# EAGLE design CajeroV2.0 (EAGLE 8.7.0)
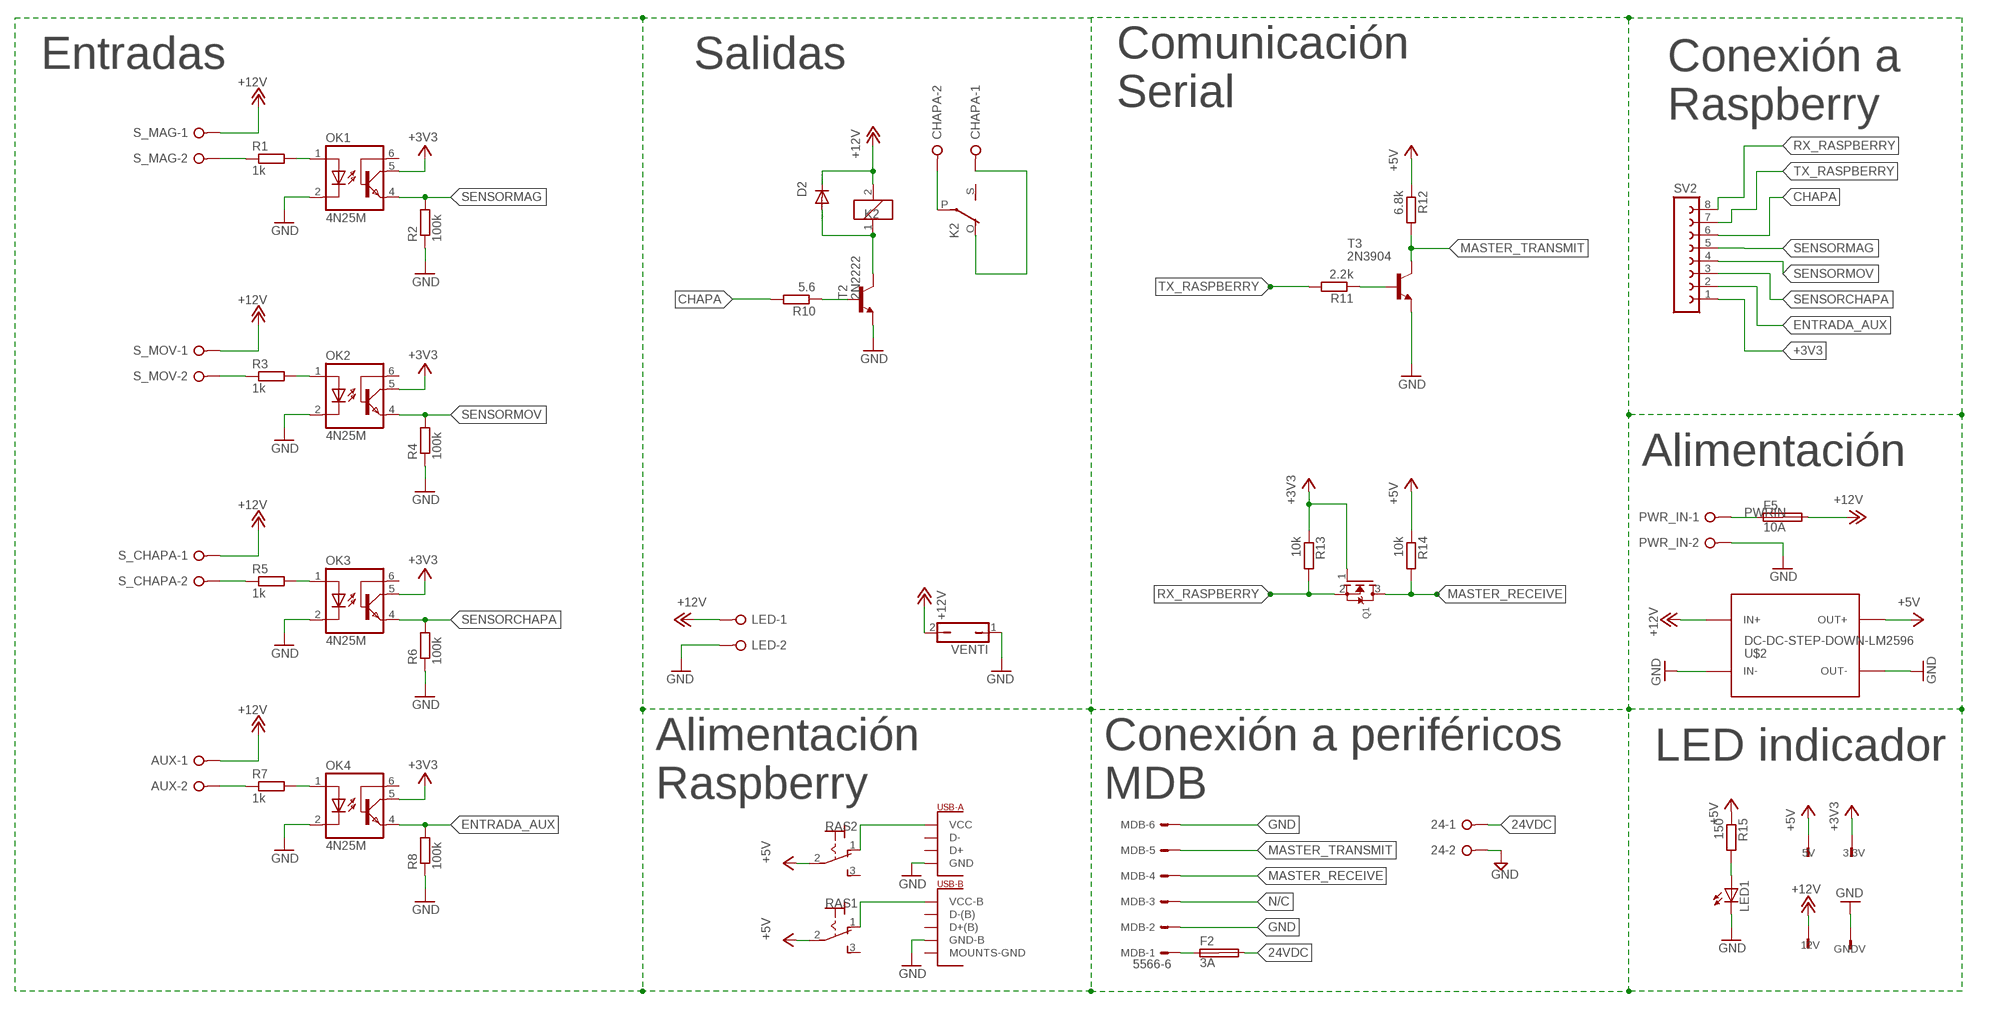
[diagram p0: schematic, sheet 1]

## Parts
3.3V  TSW-101-07-G-S  [TSW-101-XX-G-S]
5V  TSW-101-07-G-S  [TSW-101-XX-G-S]
12V  TSW-101-07-G-S  [TSW-101-XX-G-S]
24  W237-02P  [W237-132]
AUX  W237-02P  [W237-132]
CHAPA  W237-02P  [W237-132]
D2  1N4148DO35-10  [DO35-10]
F2  3A  SHK20L  [SHK20L]
F5  10A  SHK20L  [SHK20L]
GNDV  TSW-101-07-G-S  [TSW-101-XX-G-S]
K2  G5LE  [G5LE]
LED  W237-02P  [W237-132]
LED1  LED5MM  [LED5MM]
MDB  5566-6  [5566-6]
OK1  4N25M  [DIL06]
OK2  4N25M  [DIL06]
OK3  4N25M  [DIL06]
OK4  4N25M  [DIL06]
PWR_IN  W237-02P  [W237-132]
Q1  MOSFET-NREFLOW  [SOT23]
R1  1k  R-EU_0207/7  [0207/7]
R2  100k  R-EU_0207/7  [0207/7]
R3  1k  R-EU_0207/7  [0207/7]
R4  100k  R-EU_0207/7  [0207/7]
R5  1k  R-EU_0207/7  [0207/7]
R6  100k  R-EU_0207/7  [0207/7]
R7  1k  R-EU_0207/7  [0207/7]
R8  100k  R-EU_0207/7  [0207/7]
R10  5.6  R-EU_0207/7  [0207/7]
R11  2.2k  R-EU_0207/7  [0207/7]
R12  6.8k  R-EU_0207/7  [0207/7]
R13  10k  R-EU_0207/7  [0207/7]
R14  10k  R-EU_0207/7  [0207/7]
R15  150  R-EU_0207/7  [0207/7]
RAS1  320-916  [320-916]
RAS2  320-916  [320-916]
S_CHAPA  W237-02P  [W237-132]
S_MAG  W237-02P  [W237-132]
S_MOV  W237-02P  [W237-132]
SV2  FE08-1  [FE08]
T2  2N2222  [TO18]
T3  2N3904  [TO92]
U$1  DUAL-PORT-USB-REC  [DUAL-PORT-USB]
U$2  DC-DC-STEP-DOWN-LM2596  [DC-DC-STEP-DOWN-LM2596]
VENTI  JP1Q  [JP1]

## Nets
24VDC: 24.1 F2.2A
+3V3: 3.3V.1 OK1.5(COL) OK2.5(COL) OK3.5(COL) OK4.5(COL) Q1.1(G) R13.1 SV2.1
+5V: 5V.1 R12.1 R14.1 R15.1 RAS1.2(P) RAS2.2(P) U$2.OUT+
+12V: 12V.1 AUX.1 D2.C F5.2A K2.2 LED.1 S_CHAPA.1 S_MAG.1 S_MOV.1 U$2.IN+ VENTI.2
CHAPA: R10.2 SV2.6
ENTRADA_AUX: OK4.4(EMI) R8.2 SV2.2
GND: 24.2 GNDV.1 LED1.K(C) LED.2 MDB.2 MDB.6 OK1.2(C) OK2.2(C) OK3.2(C) OK4.2(C) PWR_IN.2 R2.1 R4.1 R6.1 R8.1 T2.1(E) T3.3(E) U$1.P$9(GND-B) U$1.P$11(GND) U$2.IN- U$2.OUT- VENTI.1
MASTER_RECEIVE: MDB.4 Q1.3(D) R14.2
MASTER_TRANSMIT: MDB.5 R12.2 T3.1(C)
N$1: OK1.1(A) R1.2
N$2: R1.1 S_MAG.2
N$3: OK2.1(A) R3.2
N$4: R3.1 S_MOV.2
N$5: OK3.1(A) R5.2
N$6: R5.1 S_CHAPA.2
N$7: OK4.1(A) R7.2
N$8: AUX.2 R7.1
N$10: R10.1 T2.2(B)
N$15: D2.A K2.1 T2.3(C)
N$16: CHAPA.2 K2.P(2:P)
N$17: CHAPA.1 K2.O(2:O)
N$18: R11.1 T3.2(B)
N$20: RAS2.1(O) U$1.P$12(VCC)
N$21: F2.1A MDB.1
N$23: LED1.A R15.2
N$25: RAS1.1(O) U$1.P$10(VCC-B)
N/C: MDB.3
PWRIN: F5.1A PWR_IN.1
RX_RASPBERRY: Q1.2(S) R13.2 SV2.8
SENSORCHAPA: OK3.4(EMI) R6.2 SV2.3
SENSORMAG: OK1.4(EMI) R2.2 SV2.5
SENSORMOV: OK2.4(EMI) R4.2 SV2.4
TX_RASPBERRY: R11.2 SV2.7
Unconnected: F2.1B F2.2B F5.1B F5.2B K2.S(2:S) OK1.6(BAS) OK2.6(BAS) OK3.6(BAS) OK4.6(BAS) RAS1.3(S) RAS2.3(S) U$1.P$5(D-(B)) U$1.P$6(D+(B)) U$1.P$7(D-) U$1.P$8(D+)

## Notes on the sheet
- Entradas | Salidas
- Comunicación
  Serial
- Conexión a 
  Raspberry
- Alimentación
- LED indicador
- Alimentación 
  Raspberry
- Conexión a periféricos
  MDB

## Power pins joined to a net without a drawn wire
MOUNTS-GND: U$1.GND(MOUNTS-GND) U$1.P$2(MOUNTS-GND) U$1.P$3(MOUNTS-GND) U$1.P$4(MOUNTS-GND)

## Library data of the parts
3.3V 5V 12V GNDV = con-samtec:TSW-101-*-G-S: THROUGH-HOLE .025" SQ POST HEADER Source: Samtec TSW.pdf; MF: Samtec Inc.; MPN: TSW-101-07-G-S
24 AUX CHAPA LED PWR_IN S_CHAPA S_MAG S_MOV = con-wago-508:W237-02P: WAGO SREW CLAMP; OC_FARNELL: unknown; OC_NEWARK: unknown
D2 = diode:1N4148: DIODE high speed (Philips)
F2 F5 = fuse:SHK20L: FUSE HOLDER 5 x 20 mm, SH contact, SHH1 Schukat, E1073 Buerklin; OC_FARNELL: unknown; OC_NEWARK: unknown
K2 = relay:G5LE: RELAY 1 x switch, 10 A/120 V AC, 8 A/30 V DC, Omron; OC_FARNELL: unknown; OC_NEWARK: unknown
LED1 = adafruit:LED: LED OSRAM: - CHIPLED LG R971, LG N971, LY N971, LG Q971, LY Q971, LO R971, LY R971 LH N974, LH R974 LS Q976, LO Q976, LY Q976 LO Q996 - Hyper CHIPLED LW Q18S LB Q993, LB Q99A, LB R99A - SideLED LS A670, LO A670, LY A670, LG A670, LP A670 LB A673, LV A673, LT A673, LW A673 LH A674 LY A675 LS A676, LA A676, LO A676, LY A676, LW A676 LS A679, LY A679, LG A679 - Hyper Micro SIDELED® LS Y876, LA Y876, LO Y876, LY Y876 LT Y87S - SmartLED LW L88C, LW L88S LB L89C, LB L89S, LG L890 LS L89K, LO L89K, LY L89K LS L896, LA L896, LO L896, LY L896 - TOPLED LS T670, LO T670, LY T670, LG T670, LP T670 LSG T670, LSP T670, LSY T670, LOP T670, LYG T670 LG T671, LOG T671, LSG T671 LB T673, LV T673, LT T673, LW T673 LH T674 LS T676, LA T676, LO T676, LY T676, LB T676, LH T676, LSB T676, LW T676 LB T67C, LV T67C, LT T67C, LS T67K, LO T67K, LY T67K, LW E67C LS E67B, LA E67B, LO E67B, LY E67B, LB E67C, LV E67C, LT E67C LW T67C LS T679, LY T679, LG T679 LS T770, LO T770, LY T770, LG T770, LP T770 LB T773, LV T773, LT T773, LW T773 LH T774 LS E675, LA E675, LY E675, LS T675 LS T776, LA T776, LO T776, LY T776, LB T776 LHGB T686 LT T68C, LB T68C - Hyper Mini TOPLED® LB M676 - Mini TOPLED Santana® LG M470 LS M47K, LO M47K, LY M47K Source: http://www.osram.convergy.de/
MDB = con-molex:5566-6: Mini FIT connector 6 pol Source: http://www.molex.com; MF: MOLEX; MPN: 95566-61002; OC_FARNELL: unknown; OC_NEWARK: 22K8620
OK1-OK4 = optocoupler:4N*?M: General Purpose 6-Pin Phototransistor Optocouplers Source: http://www.fairchildsemi.com/ds/4N/4N35-M.pdf; MPN: 4N25-M; OC_FARNELL: 1021349; OC_NEWARK: 98K9084
Q1 = adafruit:MOSFET-N: N-Channel Mosfet 2N7002E - 60V 260mA SOT23 [Digikey: 2N7002ET1GOSTR-ND] - REEL BSH103 - 30V 850mA SOT23 [Digikey: 568-5013-1-ND]
R1-R8 R10-R15 = rcl:R-EU_: RESISTOR, European symbol; SPICEPREFIX: R
RAS1 RAS2 = switch:320-916: TOGGLE SWITCH distributor RS Components
SV2 = con-lsta:FE08-1: FEMALE HEADER; OC_FARNELL: unknown; OC_NEWARK: unknown
T2 = transistor:2N2222: NPN TRANSISTOR
T3 = transistor:2N3904: NPN TRANSISTOR
U$1 = tps2511:DUAL-PORT-USB-REC: Dual USB Receptacle, Horizontal.
U$2 = diy-modules:DC-DC-STEP-DOWN-LM2596: DC/DC Step-Down Regulator based on LM2596-ADJ chip LM2596 datasheet available here: http://www.ti.com/lit/ds/symlink/lm2596.pdf Click here to find device on ebay.com <http://www.ebay.com/sch/lm2596+power+regulator>
VENTI = jumper:JP1Q: JUMPER

## Board
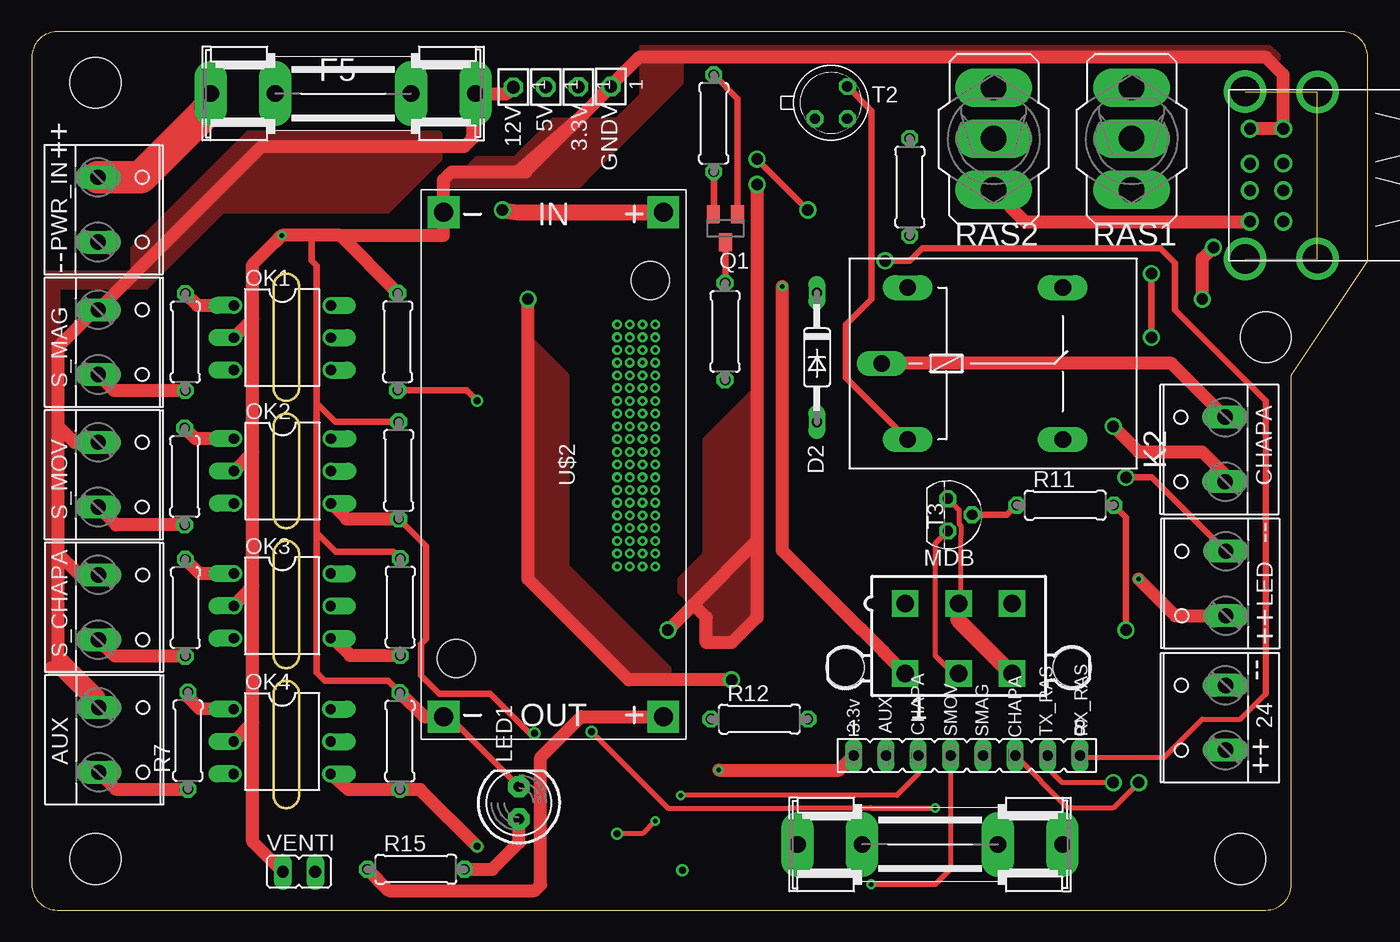
[diagram p1: board, top side]
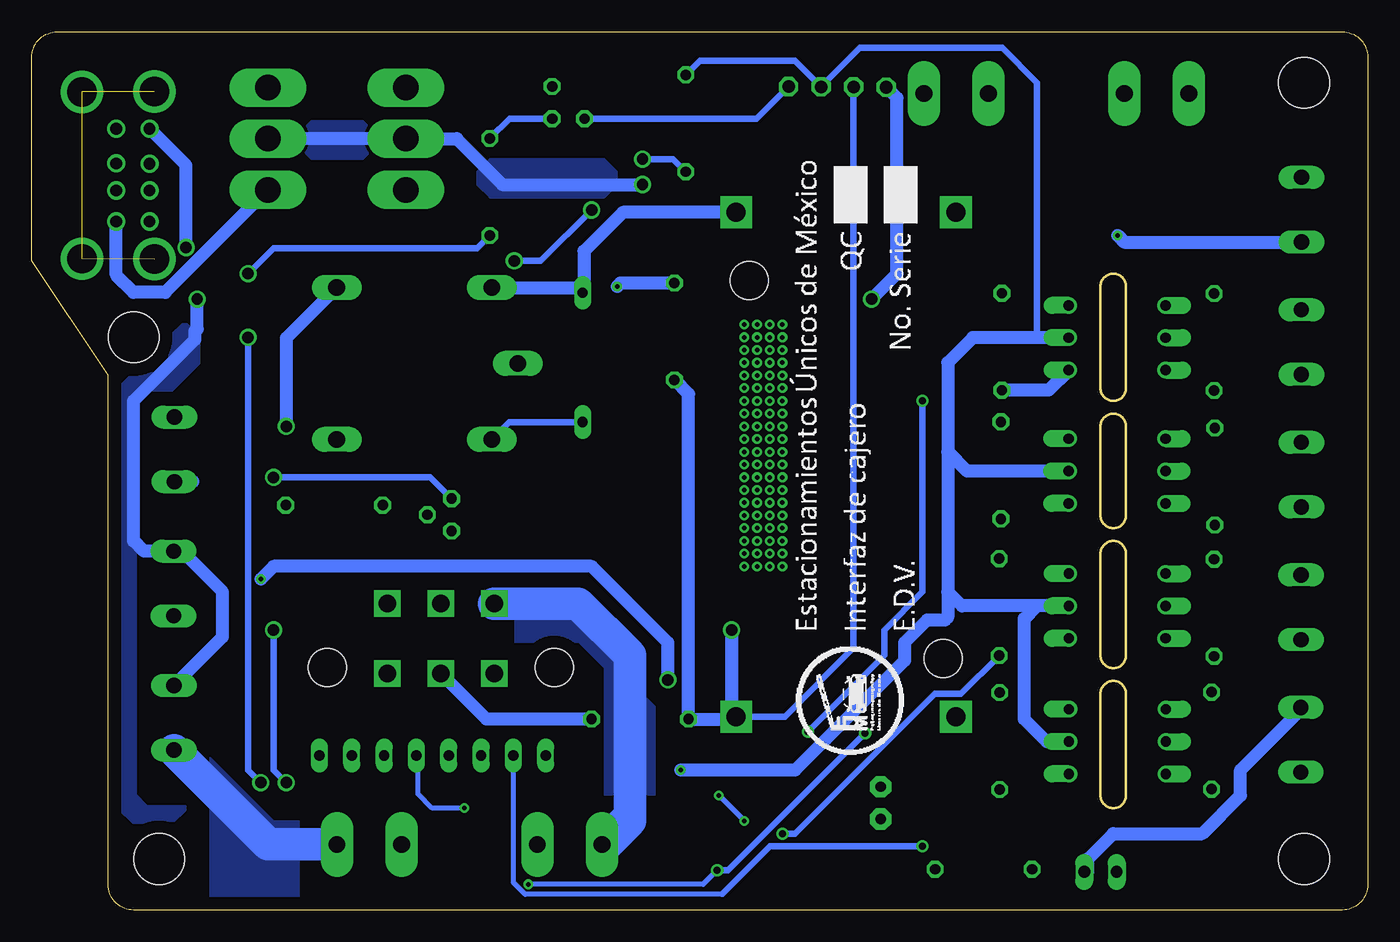
[diagram p2: board, bottom side, seen from below]

Size 105 x 69 mm. Coordinates in mm from the lower left corner, seen from the top.
Outline: 0,2 arc90 2,0 97,0 arc90 99,2 99,42 105,51 105,67 arc90 103,69 2,69 arc90 0,67 0,2
Outline: 19,49 19,41 arc180 21,41 21,49 arc180 19,49
Outline: 21,38 21,31 arc-180 19,31 19,38 arc-180 21,38
Outline: 21,28 21,20 arc-180 19,20 19,28 arc-180 21,28
Outline: 19,17 19,9 arc180 21,9 21,17 arc180 19,17
Copper layers (1*16): Top 0.035mm / dielectric 1.5mm / Bottom 0.035mm
Design rules "default": minimum track width 6mil, minimum drill 0.35mm, track to track 6mil, track to pad 6mil, pad to pad 6mil, via to via 6mil, smd to smd 6mil, copper to edge 40mil, drill to drill 6mil, minimum pad ring 10mil, minimum via ring 8mil, stop-mask expansion 4mil, vias tented up to drill 0mil, thermal gap 10mil
Holes 4 mm at 5,65 95,4 5,4 97,45

### Footprints (pad centres in the part's own frame; a part is rotated, then mirrored left to right if it is on the bottom)
TSW-101-XX-G-S = drill 1 pad 1.5 octagon: 1 0,0
W237-132 = drill 1.194 long: 1 -2.54,-0.635; 2 2.54,-0.635
DO35-10 = drill 0.813 long: A 5.08,0; C -5.08,0
SHK20L = drill 1.321 pad 2.54 long: 1A -10.414,0; 1B -5.334,0; 2A 10.414,0; 2B 5.334,0
G5LE = drill 1.321 long: 1 -7.493,-5.969; 2 -7.493,5.969; O 4.699,5.969; P -9.525,0; S 4.699,-5.969
LED5MM = drill 0.813 pad 1.676 octagon: A -1.27,0; K 1.27,0
5566-6 = drill 1.4 square: 1 4.2,-2.75; 2 0,-2.75; 3 -4.2,-2.75; 4 4.2,2.75; 5 0,2.75; 6 -4.2,2.75 | hole 3: 8.9,2.29; -8.9,2.29
DIL06 = drill 0.813 offset: 1 -2.54,-3.81; 2 0,-3.81; 3 2.54,-3.81; 4 2.54,3.81; 5 0,3.81; 6 -2.54,3.81
SOT23 = smd 1 x 1.4: 1 -0.95,-1.1; 2 0.95,-1.1; 3 0,1.1
0207/7 = drill 0.813 octagon: 1 -3.81,0; 2 3.81,0
320-916 = drill 2.007 long: 1 0,4.013; 2 0,0; 3 0,-4.013
FE08 = drill 0.813 long: 1 -8.89,0; 2 -6.35,0; 3 -3.81,0; 4 -1.27,0; 5 1.27,0; 6 3.81,0; 7 6.35,0; 8 8.89,0
TO18 = drill 0.813 octagon: 1 -1.27,-1.27; 2 1.27,-1.27; 3 1.27,1.27
TO92 = drill 0.813 octagon: 1 1.27,0; 2 0,1.905; 3 -1.27,0
DUAL-PORT-USB = drill 2.311: GND -7.645,0.127; P$2 -7.62,-5.563; P$3 5.512,0.127; P$4 5.486,-5.563 | drill 0.92: P$5 -2.261,-2.87; P$6 -0.127,-2.87; P$7 -2.261,-0.254; P$8 -0.152,-0.254; P$9 2.591,-2.87; P$10 -4.699,-2.87; P$11 2.591,-0.254; P$12 -4.699,-0.254
DC-DC-STEP-DOWN-LM2596 = drill 1.5 pad 2.5 square: IN+ -19.812,8.636; IN- -19.812,-8.636; OUT+ 19.812,8.636; OUT- 19.812,-8.636 | hole 3: -14.478,7.62; 15.24,-7.62
JP1 = drill 0.914 long: 1 0,-1.27; 2 0,1.27

### Placement (x,y rotation side)
3.3V  42.96,64.67 90 top
5V  40.4,64.67 90 top
12V  37.85,64.65 90 top
24  93.19,15.1 90 top
AUX  5.89,13.37 270 top
CHAPA  93.16,36.19 90 top
D2  61.71,43.42 270 top
F2  70.6,5.15 0 top
F5  24.47,64.15 0 top
GNDV  45.52,64.7 90 top
K2  76.33,42.94 0 top
LED  93.22,25.65 90 top
LED1  38.29,8.41 90 top
MDB  72.85,21.33 180 top
OK1  19.69,44.97 270 top
OK2  19.71,34.49 270 top
OK3  19.68,23.89 270 top
OK4  19.67,13.24 270 top
PWR_IN  5.83,55.02 270 top
Q1  54.52,53.56 180 top
R1  12.07,44.63 90 top
R2  28.76,44.65 270 top
R3  12.02,34.06 90 top
R4  28.83,34.54 270 top
R5  12.07,23.75 90 top
R6  28.96,23.8 270 top
R7  12.27,13.31 90 top
R8  28.93,13.27 270 top
R10  69,56.81 270 top
R11  81.23,31.81 0 top
R12  57.19,15 0 top
R13  53.6,61.81 270 top
R14  54.49,45.45 90 top
R15  30.19,3.2 0 top
RAS1  86.45,60.6 180 top
RAS2  75.61,60.6 180 top
S_CHAPA  5.87,23.79 270 top
S_MAG  5.85,44.62 270 top
S_MOV  5.85,34.2 270 top
SV2  73.5,12.15 0 top
T2  62.83,63.44 0 top
T3  72,31.05 270 top
U$1  95.49,58.79 90 top
U$2  41,35 270 top
VENTI  21,3 270 top

### Tracks (layer width: path | path; a pad name or v marks a point on that pad's centre or on a via)
24VDC
  Bottom 2.54: F2.2A 86.41,5.15 24.1
  pour Bottom: 84,7 84,1 91,1 91,12 86,7
+3V3  (via drill 0.35)
  Top 0.508: Q1.1 55.47,63.75 R13.1
  Top 1.016: v54,11 63.46,11 SV2.1
  Bottom 0.508: 26,44.97 26,65 28.73,67.73 39.9,67.73 3.3V.1 45,66.71 45,66.73 52.49,66.73 R13.1
  Bottom 1.016: OK1.5 26,44.97 31.03,44.97 33,43 33,36 | 33,36 33,25 | 33,25 33,23 33.22,22.78 34.63,22.78 36.4,21.01 36.4,19.6 45,11 v54,11 | OK2.5 31.49,34.49 33,36 | OK3.5 26,23.89 | 26,23.89 31.89,23.89 33,25 | OK4.5 25.23,13.23 27,15 27,22.89 26,23.89
+5V  (via drill 0.9)
  Top 1.016: R15.1 28.06,1.52 39.52,1.52 40,2 40,12 43.19,15.19 U$2.OUT+ | 52,24 57,29 v57,57 57,23 55,21 53,21 53,23 52,24 | 52,24 v50,22
  Bottom 0.508: 5V.1 40.4,20.6 45.81,15.19 U$2.OUT+ | 54.42,41.58 R14.1
  Bottom 1.016: v57,57 68,57 71.6,60.6 RAS2.2 RAS1.2 | v50,22 50,15.55 U$2.OUT+ 49.82,15 R12.1 53.38,40.53 54.42,41.58
  pour Top: 57,41 53,37 53,28 51,26 51,25 53,23 53,21 55,21 57,23
  pour Bottom: 83,62 79,62 78,61 78,60 79,59 83,59 84,60 84,61
  pour Bottom: 59,58 60,59 69,59 70,58 70,57 69,56 60,56 59,57
+12V  (via drill 0.35, 0.9)
  Top 0.152: 5,47.16 S_MAG.1
  Top 1.016: AUX.1 2.08,19.09 2.08,20 | 2.08,20 2.08,28 | 2.08,28 2.08,38 | 2.08,38 2.08,44.24 5,47.16 | S_CHAPA.1 3.76,26.33 2.08,28 | S_MOV.1 3.34,36.74 2.08,38 | S_MAG.1 18.05,60 34,60 34.63,60.63 F5.2A 37.34,64.15 12V.1 | v55,18.08 46.92,18.08 39,26 v39,48 | 2.08,20 5.26,16.83 AUX.1 | AUX.1 2.17,19 1.52,19 | v87,26 89.89,23.11 LED.1
  Top 1.27: v37,55 38.19,54.81 U$2.IN+
  Bottom 1.016: VENTI.2 22,3 22,4 20,6 13,6 10,9 10,11 5,16 AUX.1 | U$2.IN+ 58.55,54.81 61.59,51.77 61.59,48.62 | 61.59,48.62 D2.C | K2.2 61.89,48.91 61.59,48.62 | v39,48 37,50 v37,55 37,63.81 12V.1 | v55,18.08 55,21 61,27 86,27 v87,26
  pour Top: 2,49 9,49 15,55 28,55 32,59 32,61 17,61 8,52 8,51 8,50 2,50
  pour Top: 2,50 1,50 1,19 3,19 2,20 2,25
  pour Top: 39,45 42,42 42,27 50,19 50,18 47,18 39,26
CHAPA  (via drill 0.9)
  Top 0.406: v87,10 85,8 81.73,8 81.69,8.05 81.41,8.05 SV2.6
  Top 0.508: v88,50 v88,45
  Bottom 0.508: R10.2 70,52 86,52 v88,50 | v88,45 88,11 v87,10
ENTRADA_AUX  (via drill 0.55)
  Top 1.016: OK4.4 24.89,9.46 R8.2 30.54,9.46 v35,5
  Bottom 0.406: 50.73,1.27 50.78,1.22 66.22,1.22 67.15,2.15 SV2.2
  Bottom 0.508: v35,5 47,5 50.73,1.27
GND  (via drill 0.35, 0.9)
  Top 0.406: T3.3 72.89,31.43 72.89,30.33 73.02,30.2 73.02,29.36 73,29.34 73,24.23 MDB.2
  Top 0.508: 22,53 22,51 22.37,50.63 22.37,39.81 | R4.1 23.82,38.35 22.37,39.81 | R6.1 28.43,28.14 23.88,28.14 22.37,29.65 | 22.37,29.65 22.37,39.81 | R8.1 28.01,18 23,18 22.37,18.63 22.37,29.65 | LED1.K 32.78,15.19 U$2.OUT- | GNDV.1 44.88,64.14 37.82,58 | 32.36,57 32.36,54 | v86,34 88.05,34 LED.2
  Top 1.016: OK1.2 17.38,46.46 | 17.38,46.46 17.38,50.73 v19.64,53 | 24.22,53 32.36,53 32.36,54 U$2.IN- 32.36,57 32.36,57.36 33,58 37.82,58 38.82,58 GNDV.1 | OK2.2 17.38,35.97 | 17.38,35.97 17.38,46.46 | OK3.2 17.38,25.47 | 17.38,25.47 17.38,35.97 | 17.38,14.75 17.38,5.35 VENTI.1 | 17.38,14.75 17.38,25.47 | 19.13,52.48 v19.64,53 | R8.1 30.82,15.19 U$2.OUT- | R2.1 24.22,53 | 24.22,53 22,53 v19.64,53 | OK4.2 17.38,14.75 | 44.88,64.14 47.74,67 97,67 98.36,65.64 U$1.P$9 U$1.P$11 | v92,48 92,51.18 v92.87,52.05
  Top 1.27: MDB.6 72.85,22.78 MDB.2
  Bottom 0.508: T2.1 48.05,62.17 GNDV.1 | T3.3 73.68,34 v86,34
  Bottom 1.016: v19.64,53 19.13,52.48 PWR_IN.2 | v92,48 92,45.65 92.17,45.48 92.17,44.83 97,40 97,29 96.19,28.19 LED.2 93.19,28.19 90,25 90,21.47 24.2 | v92.87,52.05 92.87,58.51 U$1.P$11
  pour Top: 48,68 97,68 98,67 87,67 51,67 51,65 44,58 43,57 33,57 35,59 37,59 38,59 41,62 42,62 46,62 48,64
  pour Bottom: 97,7 98,8 98,41 97,42 95,42 94,43 94,45 93,46 92,45 92,43 94,41 96,41 97,40 97,9 96,8 93,8 94,7
MASTER_RECEIVE  (via drill 0.35)
  Top 0.508: Q1.3 54.52,49.29 R14.2
  Top 1.016: v59,49 59,28.23 65.17,22.06 65.2,22.06 66.97,20.29 66.97,20.26 MDB.4
  Bottom 1.016: v59,49 58.73,49.27 R14.2
MASTER_TRANSMIT
  Top 0.406: T3.1 71,28.78 71,20 72.42,18.58 MDB.5
  Bottom 1.016: R12.2 69.27,15 MDB.5
MOUNTS-GND  (3 unrouted)
N$1
  Top 1.016: R1.2 13,47.51 OK1.1
N$2
  Top 1.016: R1.1 6.47,40.82 S_MAG.2
N$3
  Top 1.016: OK2.1 12.86,37.03 R3.2
N$4
  Top 1.016: R3.1 6.62,30.25 S_MOV.2
N$5
  Top 1.016: OK3.1 13.2,26.43 R5.2
N$6
  Top 1.016: R5.1 6.54,19.94 S_CHAPA.2
N$7
  Top 1.016: OK4.1 13.17,15.83 12.27,16.73 R7.2
N$8
  Top 0.152: 12,9.5 R7.1
  Top 1.016: 12,9.5 6.59,9.5 AUX.2
N$10
  Bottom 0.508: R10.1 67.45,62.17 T2.2
N$11  (via drill 0.35)
  other vias: 49,45
N$12  (via drill 0.35)
  other vias: 48,45
N$13  (via drill 0.35)
  other vias: 47,45
N$14  (via drill 0.35)
  other vias: 46,46
N$15
  Top 0.508: T2.3 66,62.81 66,48 64,46 64,41.81 K2.1
  Bottom 0.508: D2.A 67.47,38.34 K2.1
N$16
  Top 1.016: CHAPA.2 89.58,42.94 K2.P
N$17  (via drill 0.9)
  Top 1.016: v85,38 87,36 92,36 93.79,34.21 CHAPA.1
  Bottom 1.016: 92.35,33.65 CHAPA.1 | K2.O 85,44.94 v85,38
N$18
  Top 0.508: R11.1 76.66,31.05 T3.2
N$19  (via drill 0.35)
  other vias: 46,45
N$20
  Top 1.016: RAS2.1 78.11,54.09 U$1.P$12
N$21
  Bottom 2.54: MDB.1 62.08,24.08 58,20 58,7 | 58,7 60,5 | F2.1A 58.34,7 58,7
  pour Bottom: 67,25 63,25 57,20 57,17 56,16 56,9 60,9 60,19 62,21 67,21
N$22  (via drill 0.35)
  other vias: 47,44
N$23
  Top 1.016: R15.2 36.2,3.2 38.3,5.31 38.29,5.32 LED1.A
N$24  (via drill 0.35)
  other vias: 48,44
N$25
  Bottom 1.016: RAS1.1 94.51,48.52 97,48.52 98.36,49.88 U$1.P$10
N$26  (via drill 0.35)
  other vias: 49,44
N$27  (via drill 0.35)
  other vias: 49,43
N$28  (via drill 0.35)
  other vias: 48,43
N$29  (via drill 0.35)
  other vias: 47,43
N$30  (via drill 0.35)
  other vias: 46,43
N$31  (via drill 0.35)
  other vias: 46,42
N$32  (via drill 0.35)
  other vias: 47,42
N$33  (via drill 0.35)
  other vias: 48,42
N$34  (via drill 0.35)
  other vias: 49,42
N$35  (via drill 0.35)
  other vias: 49,41
N$36  (via drill 0.35)
  other vias: 48,41
N$37  (via drill 0.35)
  other vias: 46,41
N$38  (via drill 0.35)
  other vias: 47,41
N$39  (via drill 0.35)
  other vias: 46,40
N$40  (via drill 0.35)
  other vias: 47,40
N$41  (via drill 0.35)
  other vias: 48,40
N$42  (via drill 0.35)
  other vias: 49,40
N$43  (via drill 0.35)
  other vias: 49,39
N$44  (via drill 0.35)
  other vias: 47,39
N$45  (via drill 0.35)
  other vias: 46,39
N$46  (via drill 0.35)
  other vias: 48,39
N$47  (via drill 0.35)
  other vias: 48,38
N$48  (via drill 0.35)
  other vias: 47,38
N$49  (via drill 0.35)
  other vias: 46,38
N$50  (via drill 0.35)
  other vias: 49,38
N$51  (via drill 0.35)
  other vias: 49,37
N$52  (via drill 0.35)
  other vias: 48,37
N$53  (via drill 0.35)
  other vias: 47,37
N$54  (via drill 0.35)
  other vias: 46,37
N$55  (via drill 0.35)
  other vias: 49,36
N$56  (via drill 0.35)
  other vias: 48,36
N$57  (via drill 0.35)
  other vias: 47,36
N$58  (via drill 0.35)
  other vias: 46,36
N$59  (via drill 0.35)
  other vias: 46,35
N$60  (via drill 0.35)
  other vias: 47,35
N$61  (via drill 0.35)
  other vias: 48,35
N$62  (via drill 0.35)
  other vias: 49,35
N$63  (via drill 0.35)
  other vias: 49,34
N$64  (via drill 0.35)
  other vias: 48,34
N$65  (via drill 0.35)
  other vias: 47,34
N$66  (via drill 0.35)
  other vias: 46,34
N$67  (via drill 0.35)
  other vias: 46,33
N$68  (via drill 0.35)
  other vias: 47,33
N$69  (via drill 0.35)
  other vias: 48,33
N$70  (via drill 0.35)
  other vias: 49,33
N$71  (via drill 0.35)
  other vias: 49,32
N$72  (via drill 0.35)
  other vias: 48,32
N$73  (via drill 0.35)
  other vias: 47,32
N$74  (via drill 0.35)
  other vias: 46,32
N$75  (via drill 0.35)
  other vias: 46,31
N$76  (via drill 0.35)
  other vias: 47,31
N$77  (via drill 0.35)
  other vias: 48,31
N$78  (via drill 0.35)
  other vias: 49,31
N$79  (via drill 0.35)
  other vias: 49,30
N$80  (via drill 0.35)
  other vias: 48,30
N$81  (via drill 0.35)
  other vias: 47,30
N$82  (via drill 0.35)
  other vias: 46,30
N$83  (via drill 0.35)
  other vias: 46,28
N$84  (via drill 0.35)
  other vias: 46,29
N$85  (via drill 0.35)
  other vias: 47,29
N$86  (via drill 0.35)
  other vias: 47,28
N$87  (via drill 0.35)
  other vias: 48,29
N$88  (via drill 0.35)
  other vias: 48,28
N$89  (via drill 0.35)
  other vias: 49,29
N$90  (via drill 0.35)
  other vias: 49,28
N$92  (via drill 0.35)
  other vias: 47,46
N$93  (via drill 0.35)
  other vias: 48,46
N$94  (via drill 0.35)
  other vias: 49,46
N$95  (via drill 0.35)
  other vias: 46,27
N$96  (via drill 0.35)
  other vias: 47,27
N$97  (via drill 0.35)
  other vias: 48,27
N$98  (via drill 0.35)
  other vias: 49,27
N$99  (via drill 0.35)
  other vias: 46,44
PWRIN
  Top 2.54: PWR_IN.1 8.56,57.56 14.06,63.06 F5.1A
RX_RASPBERRY  (via drill 0.9)
  Top 0.406: SV2.8 82.53,12 89,12 92,15 95,15 97,17
  Top 0.508: R13.2 53.6,54.69 Q1.2 | 97,17 97,40 89.84,47.16 89.84,50.85 88.69,52 70,52 69,51 v67.08,51 | v61,55 v57,59
  Bottom 0.508: v67.08,51 65,51 v61,55 | v57,59 54.6,59 R13.2
SENSORCHAPA  (via drill 0.35, 0.55)
  Top 0.406: SV2.3 69.69,10.69 68,9 v51,9 | v49,7 48,6 v46,6
  Top 1.016: OK3.4 23.65,21.35 25,20 27.69,20 R6.2
  Bottom 0.406: v51,9 v49,7
  Bottom 0.508: R6.2 31.96,16.99 34.01,16.99 45,6 v46,6
SENSORMAG  (via drill 0.35, 0.55)
  Top 0.406: v44,14 50,8 59.47,8 59.51,8.05 65.94,8.05 65.98,8 v71,8
  Top 0.508: v35,40 34.16,40.84 R2.2
  Bottom 0.406: v71,8 73.53,8 74.65,9.12 74.65,12.03 SV2.5
  Bottom 0.508: v44,14 38,20 38,22 35,25 v35,40
  Bottom 1.016: OK1.4 25.08,40.84 R2.2
SENSORMOV  (via drill 0.35, 0.55)
  Top 0.406: v65.98,2.02 71.02,2.02 72.23,3.23 SV2.4
  Top 0.508: R4.2 31,28.57 31,21.3 30.61,20.91 30.61,18.39 32.01,16.99 36.01,16.99 39.11,13.89 v39.5,13.89
  Top 1.016: OK2.4 24.73,30.73 R4.2
  Bottom 0.406: v51.13,3.13 52.23,2.02 v65.98,2.02
  Bottom 0.508: v39.5,13.89 50.27,3.13 v51.13,3.13
TX_RASPBERRY  (via drill 0.9)
  Top 0.406: v85,10 81,10 79.85,11.15 SV2.7
  Top 0.508: R11.2 86,30.85 v86,22
  Bottom 0.508: v86,22 86,11 v85,10

### Text on the board
tPlace: ++ | -- | -- | ++ | -- | 1 | 3.3v | AUX | CHAPA | SMOV | SMAG | CHAPA | TX_RAS | RX_RAS | ++